# Altium schematic sheet 3Phase+Driver_STUDY.SchDoc
size A; SheetNumber: 1; SheetTotal: 1
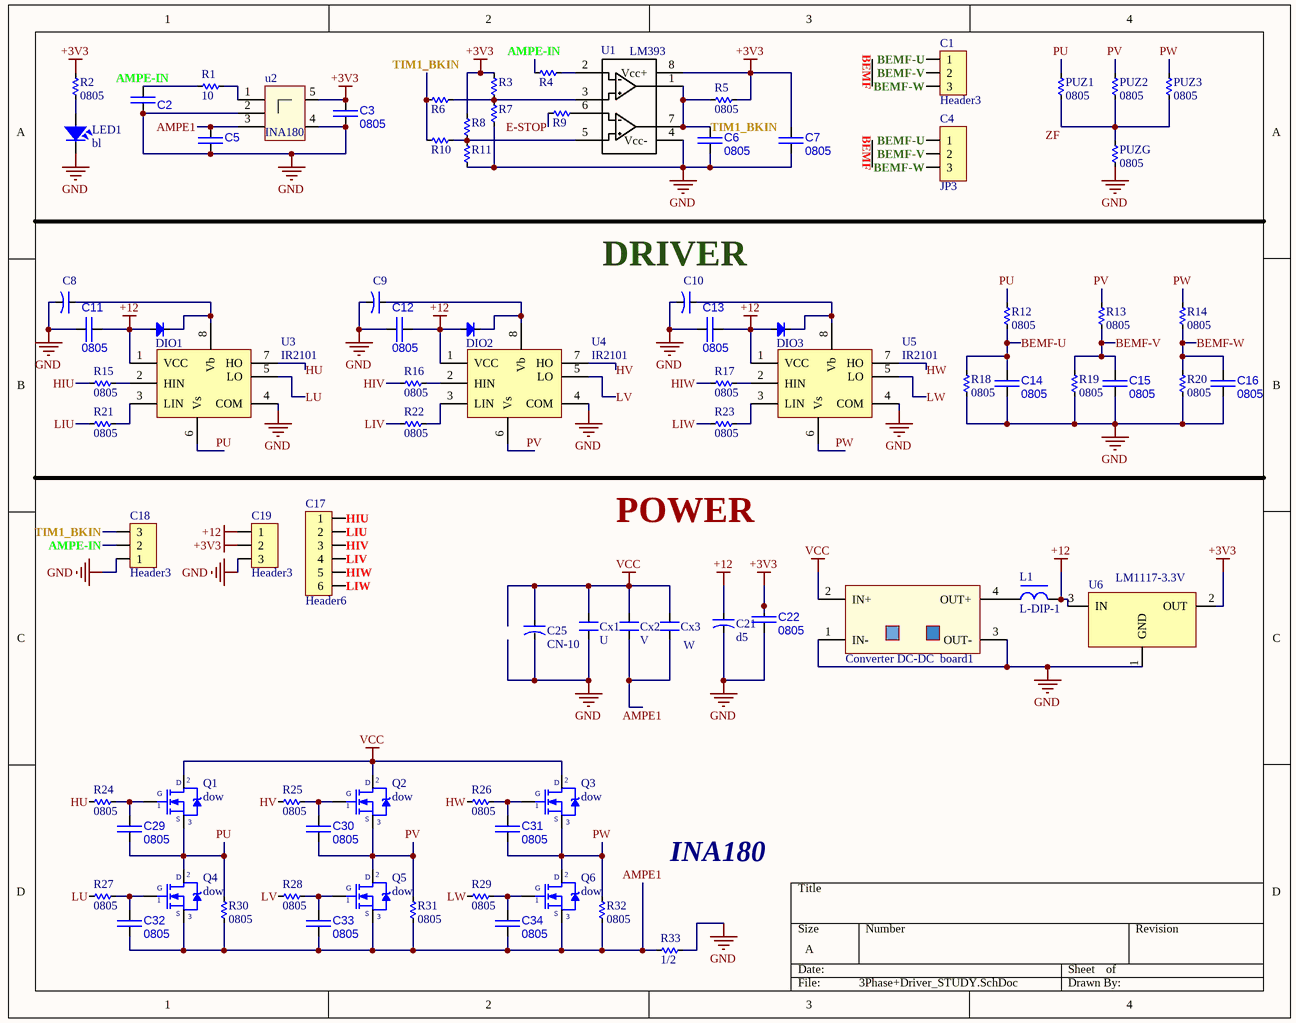
[diagram p0: 3Phase+Driver_STUDY.SchDoc]

## Parts
board1  Converter DC-DC  [mini360]
C1  Header3  [Header3]
C2  approved sub OK  [CAPC2012X135N]  (value not drawn)
C3  value 0805  [CAPC2012X135N]  (hidden comment: approved sub OK)
C4  JP3  [JP3-C1T]
C5  approved sub OK  [CAPC2012X135N]  (value not drawn)
C6  value 0805  [CAPC2012X135N]  (hidden comment: approved sub OK)
C7  value 0805  [CAPC2012X135N]  (hidden comment: approved sub OK)
C8  CN-ALU-SMD  [CAP-ALU-SMD-5.5x5.5]  (value not drawn)
C9  CN-ALU-SMD  [CAP-ALU-SMD-5.5x5.5]  (value not drawn)
C10  CN-ALU-SMD  [CAP-ALU-SMD-5.5x5.5]  (value not drawn)
C11  value 0805  [CAPC2012X135N]  (hidden comment: approved sub OK)
C12  value 0805  [CAPC2012X135N]  (hidden comment: approved sub OK)
C13  value 0805  [CAPC2012X135N]  (hidden comment: approved sub OK)
C14  value 0805  [CAPC2012X135N]  (hidden comment: approved sub OK)
C15  value 0805  [CAPC2012X135N]  (hidden comment: approved sub OK)
C16  value 0805  [CAPC2012X135N]  (hidden comment: approved sub OK)
C17  Header6  [Header6]
C18  Header3  [Header3]
C19  Header3  [Header3]
C21  d5  [CA-ALU-5]
C22  value 0805  [CAPC2012X135N]  (hidden comment: approved sub OK)
C25  CN-10  [CA-ALU-10]
C29  value 0805  [CAPC2012X135N]  (hidden comment: approved sub OK)
C30  value 0805  [CAPC2012X135N]  (hidden comment: approved sub OK)
C31  value 0805  [CAPC2012X135N]  (hidden comment: approved sub OK)
C32  value 0805  [CAPC2012X135N]  (hidden comment: approved sub OK)
C33  value 0805  [CAPC2012X135N]  (hidden comment: approved sub OK)
C34  value 0805  [CAPC2012X135N]  (hidden comment: approved sub OK)
Cx1  U  [CN2-LT]
Cx2  V  [CN2-LT]
Cx3  W  [CN2-LT]
DIO1  Diode SMD  [DIO-SMD-123]  (value not drawn)
DIO2  Diode SMD  [DIO-SMD-123]  (value not drawn)
DIO3  Diode SMD  [DIO-SMD-123]  (value not drawn)
L1  L-DIP-1  [L-DIP-M-5.3]
LED1  bl  [LED-0805-Blue]
PUZ1  0805  [RES-SMD-0805]
PUZ2  0805  [RES-SMD-0805]
PUZ3  0805  [RES-SMD-0805]
PUZG  0805  [RES-SMD-0805]
Q1  dow  [TO220NH]
Q2  dow  [TO220NH]
Q3  dow  [TO220NH]
Q4  dow  [TO220NH]
Q5  dow  [TO220NH]
Q6  dow  [TO220NH]
R1  10  [RES-SMD-0805]
R2  0805  [RES-SMD-0805]
R3  0805  [RES-SMD-0805]  (value not drawn)
R4  0805  [RES-SMD-0805]  (value not drawn)
R5  0805  [RES-SMD-0805]
R6  0805  [RES-SMD-0805]  (value not drawn)
R7  0805  [RES-SMD-0805]  (value not drawn)
R8  0805  [RES-SMD-0805]  (value not drawn)
R9  0805  [RES-SMD-0805]  (value not drawn)
R10  0805  [RES-SMD-0805]  (value not drawn)
R11  0805  [RES-SMD-0805]  (value not drawn)
R12  0805  [RES-SMD-0805]
R13  0805  [RES-SMD-0805]
R14  0805  [RES-SMD-0805]
R15  0805  [RES-SMD-0805]
R16  0805  [RES-SMD-0805]
R17  0805  [RES-SMD-0805]
R18  0805  [RES-SMD-0805]
R19  0805  [RES-SMD-0805]
R20  0805  [RES-SMD-0805]
R21  0805  [RES-SMD-0805]
R22  0805  [RES-SMD-0805]
R23  0805  [RES-SMD-0805]
R24  0805  [RES-SMD-0805]
R25  0805  [RES-SMD-0805]
R26  0805  [RES-SMD-0805]
R27  0805  [RES-SMD-0805]
R28  0805  [RES-SMD-0805]
R29  0805  [RES-SMD-0805]
R30  0805  [RES-SMD-0805]
R31  0805  [RES-SMD-0805]
R32  0805  [RES-SMD-0805]
R33  1/2  [RES-1/2W]
U1  LM393  [SO8]
u2  INA180  [SOT-23-5]
U3  IR2101  [SO8]
U4  IR2101  [SO8]
U5  IR2101  [SO8]
U6  LM1117-3.3V  [SOT223]

## Nets
+3V3: C3.2 C7.2 C19.2 C22.2 R2.1 R3.2 R5.2 R8.2 U1.8(Vcc+) u2.5(OUT) U6.2(OUT)
+12: C11.2 C12.2 C13.2 C19.1 C21.1 DIO1.1(A) DIO2.1(A) DIO3.1(A) L1.2 U3.1(VCC) U4.1(VCC) U5.1(VCC) U6.3(IN)
GND: board1.1(IN-) board1.3(OUT-) C2.2 C3.1 C5.1 C6.1 C7.1 C8.2 C9.2 C10.2 C11.1 C12.1 C13.1 C14.2 C15.2 C16.2 C18.1 C19.3 C21.2 C22.1 C25.2 Cx1.1 LED1.2 PUZG.2 R7.1 R11.1 R18.2 R19.2 R20.2 R33.1 U1.4(Vcc-) u2.2(OUT) u2.4(OUT) U3.4(COM) U4.4(COM) U5.4(COM) U6.1(GND)
VCC: board1.2(IN+) C25.1 Cx1.2 Cx2.2 Cx3.2 Q1.2(D) Q2.2(D) Q3.2(D)
AMPE1: C5.2 C32.2 C33.2 C34.2 Cx2.1 Cx3.1 Q4.3(S) Q5.3(S) Q6.3(S) R30.2 R31.2 R32.2 R33.2 u2.3(OUT)
AMPE-IN: C2.1 C18.2 R1.2 R4.2
BEMF-U: C1.1 C4.1 C14.1 R12.2 R18.1
BEMF-V: C1.2 C4.2 C15.1 R13.2 R19.1
BEMF-W: C1.3 C4.3 C16.1 R14.2 R20.1
E-STOP: R9.2
HIU: C17.1 R15.2
HIV: C17.3 R16.2
HIW: C17.5 R17.2
HU: R24.2 U3.7(HO)
HV: R25.2 U4.7(HO)
HW: R26.2 U5.7(HO)
LIU: C17.2 R21.2
LIV: C17.4 R22.2
LIW: C17.6 R23.2
LU: R27.2 U3.5(LO)
LV: R28.2 U4.5(LO)
LW: R29.2 U5.5(LO)
PU: C29.2 PUZ1.1 Q1.3(S) Q4.2(D) R12.1 R30.1 U3.6(Vs)
PV: C30.2 PUZ2.1 Q2.3(S) Q5.2(D) R13.1 R31.1 U4.6(Vs)
PW: C31.2 PUZ3.1 Q3.3(S) Q6.2(D) R14.1 R32.1 U5.6(Vs)
TIM1_BKIN: C6.2 C18.3 R5.1 R6.2 R10.2 U1.1 U1.7
ZF: PUZ1.2 PUZ2.2 PUZ3.2 PUZG.1
Netboard1_4: board1.4(OUT+) L1.1
NetC8_1: C8.1 DIO1.2(K) U3.8(Vb)
NetC9_1: C9.1 DIO2.2(K) U4.8(Vb)
NetC10_1: C10.1 DIO3.2(K) U5.8(Vb)
NetC29_1: C29.1 Q1.1(G) R24.1
NetC30_1: C30.1 Q2.1(G) R25.1
NetC31_1: C31.1 Q3.1(G) R26.1
NetC32_1: C32.1 Q4.1(G) R27.1
NetC33_1: C33.1 Q5.1(G) R28.1
NetC34_1: C34.1 Q6.1(G) R29.1
NetLED1_1: LED1.1 R2.2
NetR1_1: R1.1 u2.1(OUT)
NetR3_1: R3.1 R6.1 R7.2 U1.3
NetR4_1: R4.1 U1.2
NetR8_1: R8.1 R10.1 R11.2 U1.5
NetR9_1: R9.1 U1.6
NetR15_1: R15.1 U3.2(HIN)
NetR16_1: R16.1 U4.2(HIN)
NetR17_1: R17.1 U5.2(HIN)
NetR21_1: R21.1 U3.3(LIN)
NetR22_1: R22.1 U4.3(LIN)
NetR23_1: R23.1 U5.3(LIN)

## Notes on the sheet
- BEMF
- (near C10) DRIVER
- POWER
- INA180

## Library data of the parts
board1 = Converter DC-DC: Step DC-DC
C1 C18 C19 = Header3: Header IDC, 3 x 1 Pin Vertical 2.54mm Pitch (Non-Boxed, Male); Manufacturer: W¨¹rth Elektronik eiSos GmbH; partNo: 613002143121; ComponentLink1 Description: Manufacturer; ComponentLink2 Description: Datasheet; NoPins: 02; Created Date: 29 March 2013; ComponentLink1URL: http://www.we-online.com; ComponentLink2URL: http://katalog.we-online.de/em/datasheet/6130xx143121.pdf; Created by: Karrer Zheng
C2 C5 = CAP C_0805: Capacitor SMD Cer 1.8nF 10% 50V X7R 0805; Manufacturer 1: AVX Corporation; Manufacturer Part Number 1: 08055C182KAT2A; Ratings: 50V; X7R; SCDType: source*; Value: 0805; Tolerance: ±10%; Operating Temperature: -55°C ~ 125°C; Package / Case: 0805 (2012 metric); Supplier 1: Digi-Key; Supplier Part Number 1: 478-1374-1-ND
C3 C6 C7 C11-C16 C22 C29-C34 = CAP C_0805: Capacitor SMD Cer 1.8nF 10% 50V X7R 0805; Manufacturer 1: AVX Corporation; Manufacturer Part Number 1: 08055C182KAT2A; Ratings: 50V; X7R; SCDType: source*; Tolerance: ±10%; Operating Temperature: -55°C ~ 125°C; Package / Case: 0805 (2012 metric); Supplier 1: Digi-Key; Supplier Part Number 1: 478-1374-1-ND
C4 = JP3: WR-PHD 2.54 mm Angled Socket Header; Manufacturer: W¨¹rth Elektronik eiSos GmbH; partNo: 613003143121; ComponentLink1 Description: Manufacturer; ComponentLink2 Description: Datasheet; NoPins: 03; Created Date: 29 March 2013; ComponentLink1URL: http://www.we-online.com; ComponentLink2URL: http://katalog.we-online.de/em/datasheet/6130xx143121.pdf; Created by: Karrer Zheng
C8-C10 = CN-ALU-SMD: Polarized Capacitor (Axial); Published: 8-Jun-2000; LatestRevisionDate: 17-Jul-2002; LatestRevisionNote: Re-released for DXP Platform.; PackageReference: POLAR0.8; Publisher: Altium Limited
C17 = Header6: Header IDC, 6 x 1 Pin Vertical 2.54mm Pitch (Non-Boxed, Male); Manufacturer: W¨¹rth Elektronik eiSos GmbH; partNo: 613002143121; ComponentLink1 Description: Manufacturer; ComponentLink2 Description: Datasheet; NoPins: 02; Created Date: 29 March 2013; ComponentLink1URL: http://www.we-online.com; ComponentLink2URL: http://katalog.we-online.de/em/datasheet/6130xx143121.pdf; Created by: Karrer Zheng
C21 C25 = CN-ALU-DIP: Capacitor (Semiconductor SIM Model); Value: 104; LatestRevisionDate: 17-Jul-2002; LatestRevisionNote: Re-released for DXP Platform.; PackageReference: C1206; Publisher: Altium Limited
Cx1-Cx3 = CN: Value: 33pF
DIO1-DIO3 = Diode SMD: Default Diode; Code - JEDEC: DO-214-AB; Value: 1N5007; Published: 8-Jun-2000; Revision: July-2002: Re-released for DXP Platform.; Publisher: Altium Limited
L1 = L-DIP-1: Inductor; Value: 150 mH
LED1 = LED SMD: Value: LED 3 - 5 ly 2 Colour
PUZ1-PUZ3 PUZG R1-R32 = Res-SMD: Resistor; Manufacturer: Generic Components; Class: Passive; Published: 08/06/2000; Publisher: Altium Hobart Technology Centre
Q1-Q6 = IRF840: MOSFET N - CHANNEL 500V - 0.75 - 8A - TO-220; Value: IRF840
R33 = Res: Manufacturer: Generic Components; Class: Passive; SubClass: R; Published: 08/06/2000; Publisher: Altium Hobart Technology Centre
U1 = LM393: IC DUAL COMPARATOR
u2 = SOT-23-5_SMD: SMD_IC_SOT-23-5
U3-U5 = IR2101S: Half-Bridge Driver
U6 = LM1117: 800mA Low-Dropout Linear Regulator; Creator: Nguyen Ba Bien; Website: http://group3i.net